# Altium schematic sheet UMDK.SchDoc
size C
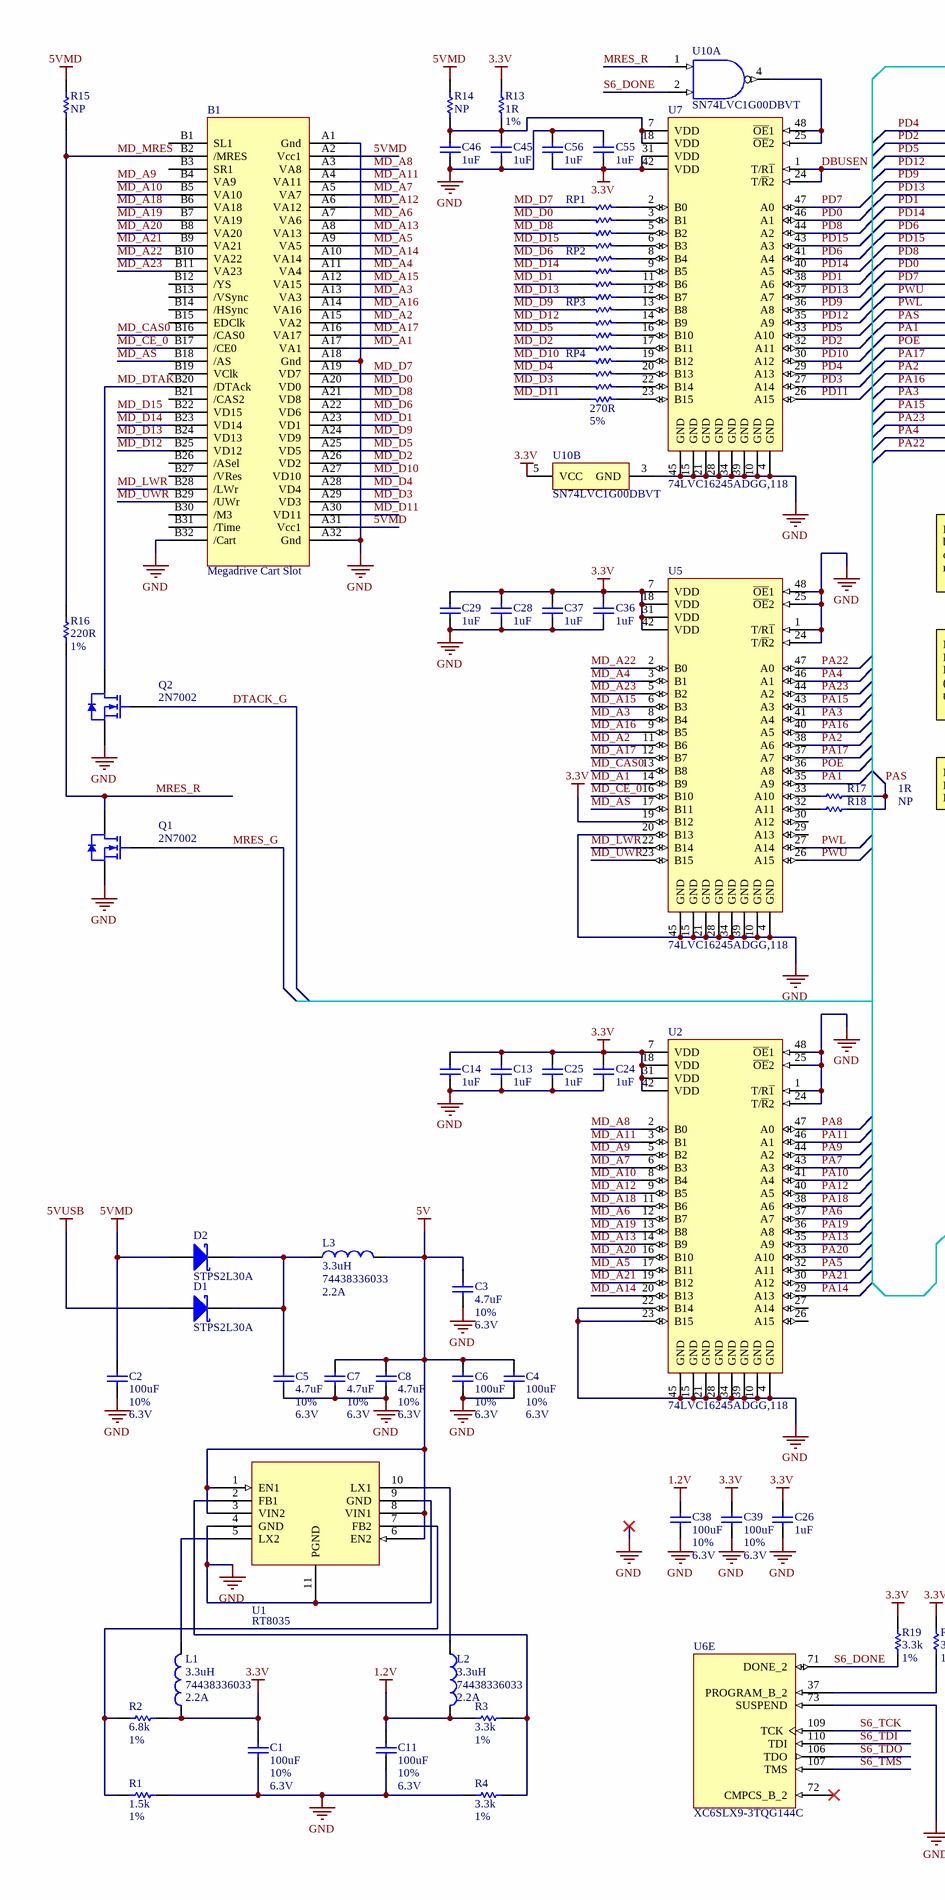
[diagram p0: UMDK.SchDoc, left]
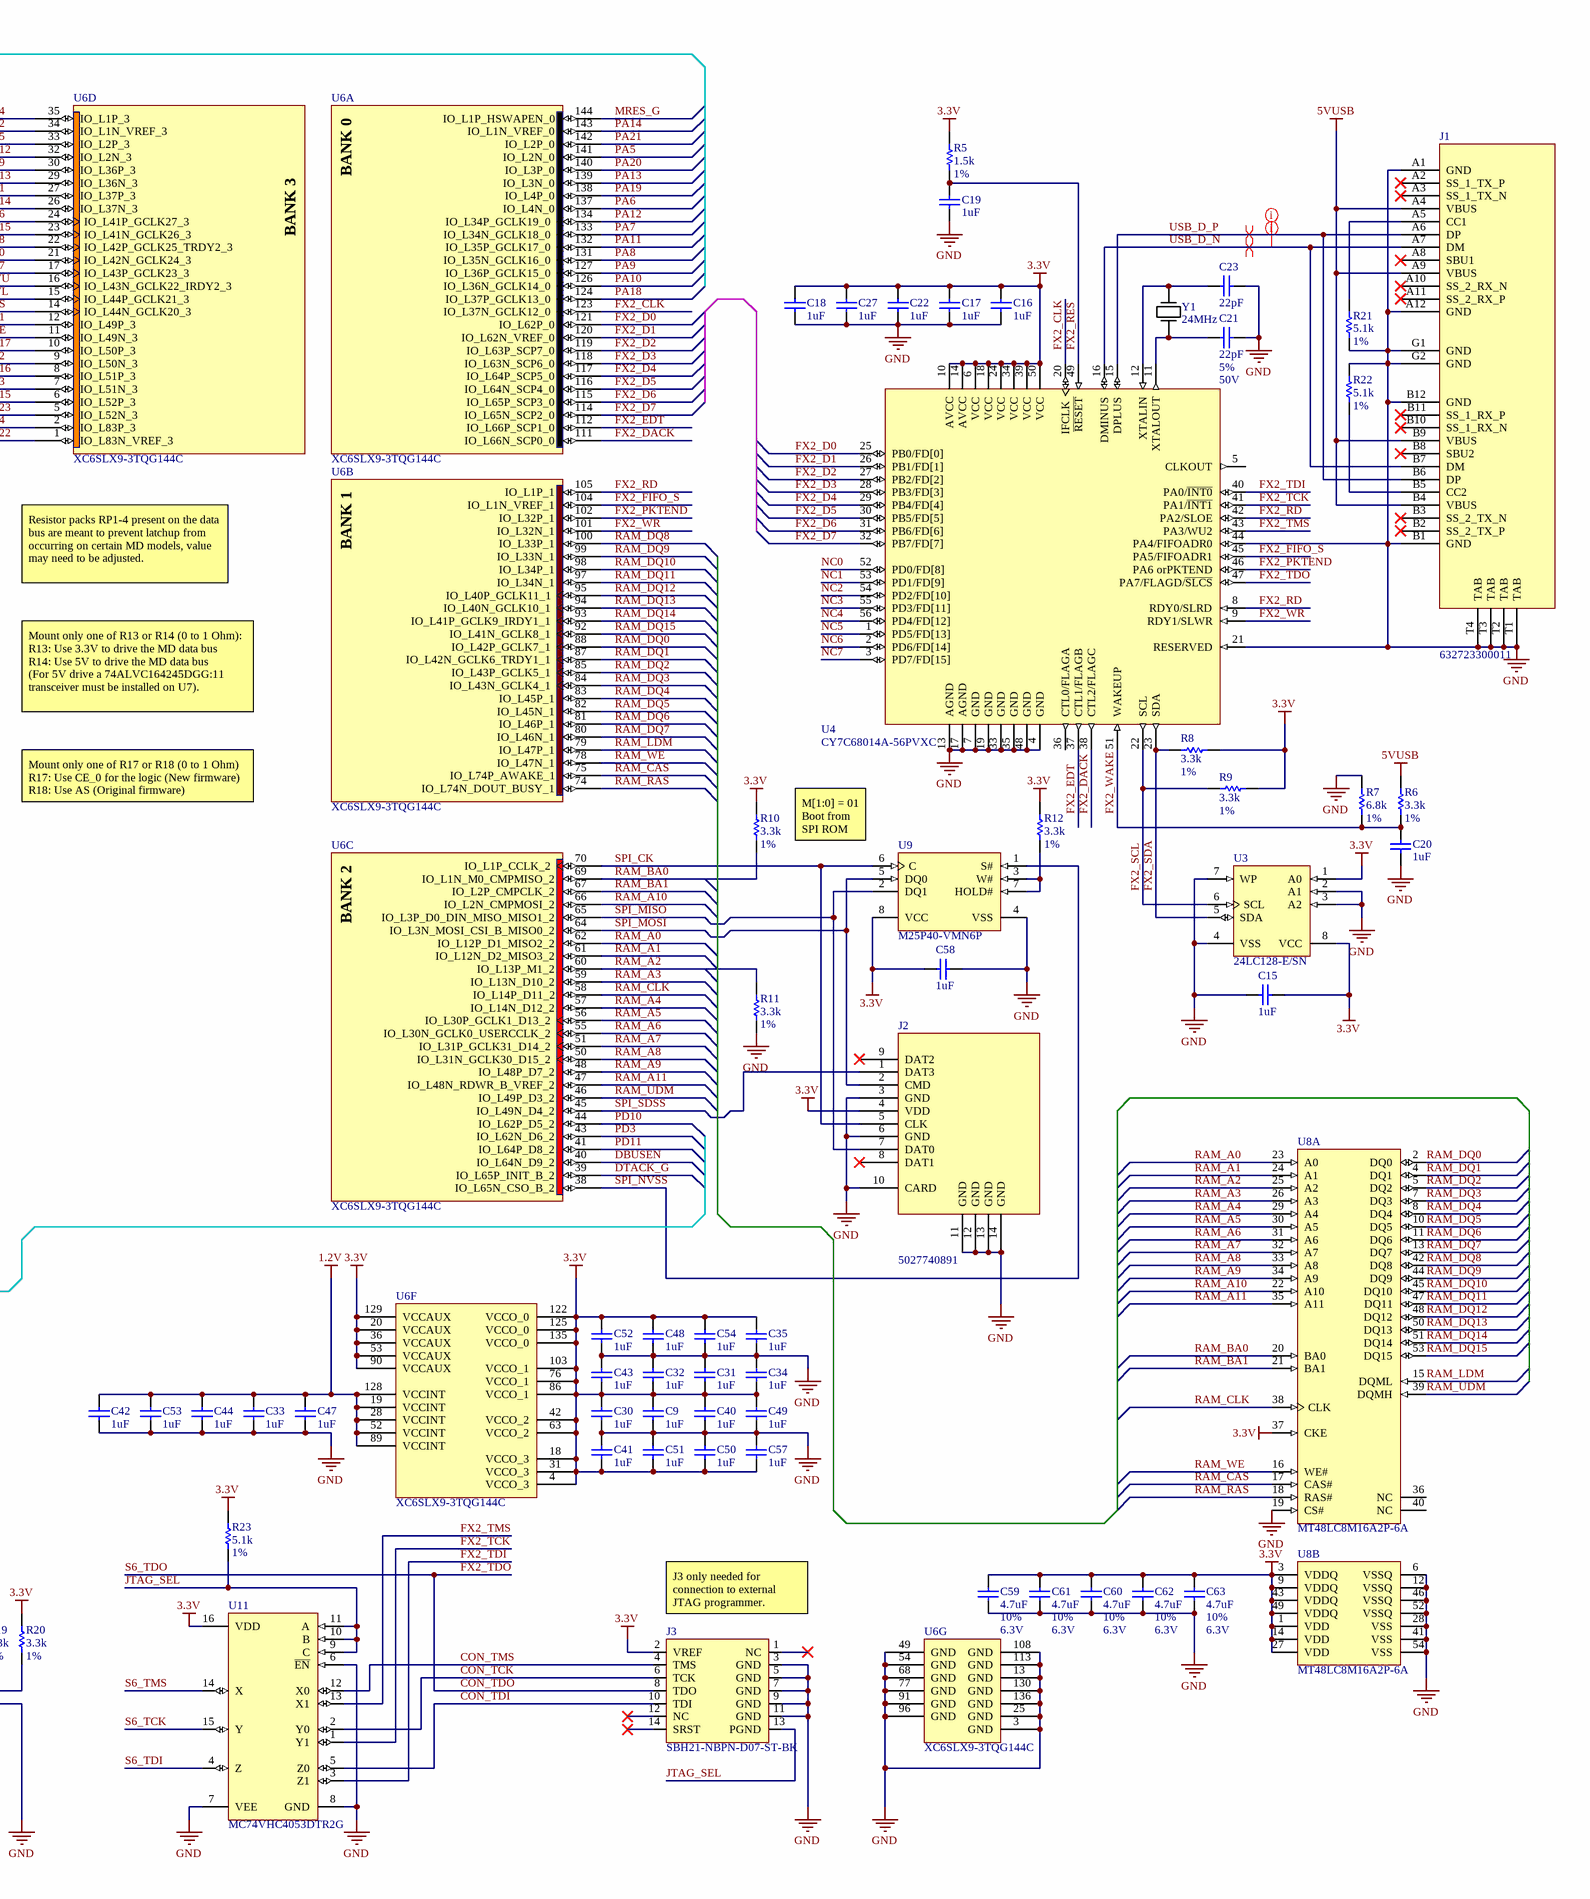
[diagram p1: UMDK.SchDoc, right]

## Parts
B1  Megadrive Cart Slot  [MD CART EDGE]  (no BOM)
C1  Tolerance: 10%  Voltage: 6.3V  [C-1210]  (hidden comment: 100uF)
C2  Tolerance: 10%  Voltage: 6.3V  [C-1210]  (hidden comment: 100uF)
C3  Tolerance: 10%  Voltage: 6.3V  [C-0603]  (hidden comment: 4.7uF)
C4  Tolerance: 10%  Voltage: 6.3V  [C-1210]  (hidden comment: 100uF)
C5  Tolerance: 10%  Voltage: 6.3V  [C-0603]  (hidden comment: 4.7uF)
C6  Tolerance: 10%  Voltage: 6.3V  [C-1210]  (hidden comment: 100uF)
C7  Tolerance: 10%  Voltage: 6.3V  [C-0603]  (hidden comment: 4.7uF)
C8  Tolerance: 10%  Voltage: 6.3V  [C-0603]  (hidden comment: 4.7uF)
C9  1uF  [C-0402]
C11  Tolerance: 10%  Voltage: 6.3V  [C-1210]  (hidden comment: 100uF)
C13  1uF  [C-0402]
C14  1uF  [C-0402]
C15  1uF  [C-0402]
C16  1uF  [C-0402]
C17  1uF  [C-0402]
C18  1uF  [C-0402]
C19  1uF  [C-0402]
C20  1uF  [C-0402]
C21  Tolerance: 5%  Voltage: 50V  [C-0402]  (hidden comment: 22pF)
C22  1uF  [C-0402]
C23  22pF  [C-0402]
C24  1uF  [C-0402]
C25  1uF  [C-0402]
C26  1uF  [C-0402]
C27  1uF  [C-0402]
C28  1uF  [C-0402]
C29  1uF  [C-0402]
C30  1uF  [C-0402]
C31  1uF  [C-0402]
C32  1uF  [C-0402]
C33  1uF  [C-0402]
C34  1uF  [C-0402]
C35  1uF  [C-0402]
C36  1uF  [C-0402]
C37  1uF  [C-0402]
C38  Tolerance: 10%  Voltage: 6.3V  [C-1210]  (hidden comment: 100uF)
C39  Tolerance: 10%  Voltage: 6.3V  [C-1210]  (hidden comment: 100uF)
C40  1uF  [C-0402]
C41  1uF  [C-0402]
C42  1uF  [C-0402]
C43  1uF  [C-0402]
C44  1uF  [C-0402]
C45  1uF  [C-0402]
C46  1uF  [C-0402]
C47  1uF  [C-0402]
C48  1uF  [C-0402]
C49  1uF  [C-0402]
C50  1uF  [C-0402]
C51  1uF  [C-0402]
C52  1uF  [C-0402]
C53  1uF  [C-0402]
C54  1uF  [C-0402]
C55  1uF  [C-0402]
C56  1uF  [C-0402]
C57  1uF  [C-0402]
C58  1uF  [C-0402]
C59  Tolerance: 10%  Voltage: 6.3V  [C-0603]  (hidden comment: 4.7uF)
C60  Tolerance: 10%  Voltage: 6.3V  [C-0603]  (hidden comment: 4.7uF)
C61  Tolerance: 10%  Voltage: 6.3V  [C-0603]  (hidden comment: 4.7uF)
C62  Tolerance: 10%  Voltage: 6.3V  [C-0603]  (hidden comment: 4.7uF)
C63  Tolerance: 10%  Voltage: 6.3V  [C-0603]  (hidden comment: 4.7uF)
D1  Manufacturer Part Number: STPS2L30A  [D-SMA]  (hidden comment: B230A-13-F)
D2  Manufacturer Part Number: STPS2L30A  [D-SMA]  (hidden comment: B230A-13-F)
J1  632723300011  [632723300011]
J2  5027740891  [5027740891]
J3  SBH21-NBPN-D07-ST-BK  [AWHW2 14G-0202]  (no BOM)
L1  Manufacturer Part Number: 74438336033  Current: 2.2A  [I-1212]  (hidden comment: 3.3uH)
L2  Manufacturer Part Number: 74438336033  Current: 2.2A  [I-1212]  (hidden comment: 3.3uH)
L3  Manufacturer Part Number: 74438336033  Current: 2.2A  [I-1212]  (hidden comment: 3.3uH)
Q1  2N7002  [T-SOT23]
Q2  2N7002  [T-SOT23]
R1  1.5k  Tolerance: 1%  [R-0402]
R2  Tolerance: 1%  [R-0402]  (hidden comment: 6.8k)
R3  Tolerance: 1%  [R-0402]  (hidden comment: 3.3k)
R4  Tolerance: 1%  [R-0402]  (hidden comment: 3.3k)
R5  1.5k  Tolerance: 1%  [R-0402]
R6  Tolerance: 1%  [R-0402]  (hidden comment: 3.3k)
R7  Tolerance: 1%  [R-0402]  (hidden comment: 6.8k)
R8  Tolerance: 1%  [R-0402]  (hidden comment: 3.3k)
R9  Tolerance: 1%  [R-0402]  (hidden comment: 3.3k)
R10  Tolerance: 1%  [R-0402]  (hidden comment: 3.3k)
R11  Tolerance: 1%  [R-0402]  (hidden comment: 3.3k)
R12  Tolerance: 1%  [R-0402]  (hidden comment: 3.3k)
R13  Tolerance: 1%  [R-0402]  (hidden comment: 1R)
R14  NP  [R-0402]  (no BOM)
R15  NP  [R-0402]  (no BOM)
R16  Tolerance: 1%  [R-0402]  (hidden comment: 220R)
R17  1R  [R-0402]
R18  NP  [R-0402]  (no BOM)
R19  Tolerance: 1%  [R-0402]  (hidden comment: 3.3k)
R20  Tolerance: 1%  [R-0402]  (hidden comment: 3.3k)
R21  Tolerance: 1%  [R-0402]  (hidden comment: 5.1k)
R22  Tolerance: 1%  [R-0402]  (hidden comment: 5.1k)
R23  Tolerance: 1%  [R-0402]  (hidden comment: 5.1k)
RP1  270R  [RP4-1206]  (value not drawn)
RP2  270R  [RP4-1206]  (value not drawn)
RP3  270R  [RP4-1206]  (value not drawn)
RP4  Tolerance: 5%  [RP4-1206]  (hidden comment: 270R)
U1  RT8035  [10SON]
U2  74LVC16245ADGG,118  [1201-01_L]
U3  24LC128-E/SN  [SOIC-SN8_N]
U4  CY7C68014A-56PVXC  [O56_N]
U5  74LVC16245ADGG,118  [1201-01_L]
U6  XC6SLX9-3TQG144C  [TQG144_N]  (parts A,B,C,D,E,F,G of 7)
U7  74LVC16245ADGG,118  [1201-01_L]
U8  MT48LC8M16A2P-6A  [MICT-P-54_N]  (parts A,B of 2)
U9  M25P40-VMN6P  [MICT-MN-8_N]
U10  SN74LVC1G00DBVT  [DBV0005A_N]  (parts A,B of 2)
U11  MC74VHC4053DTR2G  [948F-01_N]
Y1  24MHz  [CRYSTAL_HC49-US-SM]

## Nets
1.2V: C11.2 C33.1 C38.2 C42.1 C44.1 C47.1 C53.1 L2.2 R3.2 U6.19(VCCINT) U6.28(VCCINT) U6.52(VCCINT) U6.89(VCCINT) U6.128(VCCINT)
3.3V: C1.2 C9.1 C13.1 C14.1 C15.1 C16.1 C17.1 C18.1 C22.1 C24.1 C25.1 C26.1 C27.1 C28.1 C29.1 C30.1 C31.2 C32.2 C34.2 C35.1 C36.1 C37.1 C39.2 C40.1 C41.2 C43.2 C48.1 C49.1 C50.2 C51.2 C52.1 C54.1 C55.2 C56.2 C57.2 C58.2 C59.2 C60.2 C61.2 C62.2 C63.2 J2.4(VDD) J3.2(VREF) L1.1 R2.1 R5.1 R8.2 R9.2 R10.1 R12.2 R13.1 R19.1 R20.1 R23.1 U2.7(VDD) U2.18(VDD) U2.31(VDD) U2.42(VDD) U3.1(A0) U3.8(VCC) U4.6(VCC) U4.10(AVCC) U4.14(AVCC) U4.18(VCC) U4.24(VCC) U4.34(VCC) U4.39(VCC) U4.50(VCC) U5.7(VDD) U5.18(VDD) U5.19(B12) U5.31(VDD) U5.42(VDD) U6.4(VCCO_3) U6.18(VCCO_3) U6.20(VCCAUX) U6.31(VCCO_3) U6.36(VCCAUX) U6.42(VCCO_2) U6.53(VCCAUX) U6.63(VCCO_2) U6.76(VCCO_1) U6.86(VCCO_1) U6.90(VCCAUX) U6.103(VCCO_1) U6.122(VCCO_0) U6.125(VCCO_0) U6.129(VCCAUX) U6.135(VCCO_0) U7.31(VDD) U7.42(VDD) U8.1(VDD) U8.3(VDDQ) U8.9(VDDQ) U8.14(VDD) U8.27(VDD) U8.37(CKE) U8.43(VDDQ) U8.49(VDDQ) U9.8(VCC) U10.5(VCC) U11.16(VDD)
5V: C3.2 C4.2 C6.1 C7.2 C8.1 L3.2 U1.1(EN1) U1.3(VIN2) U1.6(EN2) U1.8(VIN1)
5VMD: B1.A2(Vcc1) B1.A31(Vcc1) C2.2 D2.2(A) R14.1 R15.2
5VUSB: D1.2(A) J1.A4(VBUS) J1.A9(VBUS) J1.B4(VBUS) J1.B9(VBUS) R6.1
GND: B1.A1(Gnd) B1.A18(Gnd) B1.A32(Gnd) B1.B32(/Cart) C1.1 C2.1 C3.1 C4.1 C5.1 C6.2 C7.1 C8.2 C9.2 C11.1 C13.2 C14.2 C15.2 C16.2 C17.2 C18.2 C19.2 C20.2 C21.2 C22.2 C23.2 C24.2 C25.2 C26.2 C27.2 C28.2 C29.2 C30.2 C31.1 C32.1 C33.2 C34.1 C35.2 C36.2 C37.2 C38.1 C39.1 C40.2 C41.1 C42.2 C43.1 C44.2 C45.2 C46.1 C47.2 C48.2 C49.2 C50.1 C51.1 C52.2 C53.2 C54.2 C55.1 C56.1 C57.1 C58.1 C59.1 C60.1 C61.1 C62.1 C63.1 J1.A1(GND) J1.A12(GND) J1.B1(GND) J1.B12(GND) J1.G1(GND) J1.G2(GND) J1.T1(TAB) J1.T2(TAB) J1.T3(TAB) J1.T4(TAB) J2.3(GND) J2.6(GND) J2.10(CARD) J2.11(GND) J2.12(GND) J2.13(GND) J2.14(GND) J3.3(GND) J3.5(GND) J3.7(GND) J3.9(GND) J3.11(GND) Q1.2(SOURCE) Q2.2(SOURCE) R1.2 R4.2 R7.2 R11.2 R21.2 R22.1 U1.4(GND) U1.9(GND) U1.11(PGND) U2.1(T/R~{1}) U2.4(GND) U2.10(GND) U2.15(GND) U2.21(GND) U2.22(B14) U2.23(B15) U2.24(T/~{R}2) U2.25(~{OE}2) U2.28(GND) U2.34(GND) U2.39(GND) U2.45(GND) U2.48(~{OE}1) U3.2(A1) U3.3(A2) U3.4(VSS) U3.7(WP) U4.4(GND) U4.7(GND) U4.13(AGND) U4.17(AGND) U4.19(GND) U4.21(RESERVED) U4.33(GND) U4.35(GND) U4.44(PA4/FIFOADR0) U4.48(GND) U5.1(T/R~{1}) U5.4(GND) U5.10(GND) U5.15(GND) U5.20(B13) U5.21(GND) U5.24(T/~{R}2) U5.25(~{OE}2) U5.28(GND) U5.34(GND) U5.39(GND) U5.45(GND) U5.48(~{OE}1) U6.3(GND) U6.13(GND) U6.25(GND) U6.49(GND) U6.54(GND) U6.68(GND) U6.73(SUSPEND) U6.77(GND) U6.91(GND) U6.96(GND) U6.108(GND) U6.113(GND) U6.130(GND) U6.136(GND) U7.4(GND) U7.10(GND) U7.15(GND) U7.21(GND) U7.28(GND) U7.34(GND) U7.39(GND) U7.45(GND) U8.6(VSSQ) U8.12(VSSQ) U8.19(CS#) U8.28(VSS) U8.41(VSS) U8.46(VSSQ) U8.52(VSSQ) U8.54(VSS) U9.4(VSS) U10.3(GND) U11.6(~{EN}) U11.7(VEE) U11.8(GND)
CON_TCK: J3.6(TCK) U11.2(Y0)
CON_TDI: J3.10(TDI) U11.5(Z0)
CON_TDO: J3.8(TDO) U4.47(PA7/FLAGD/~{SLCS}) U6.106(TDO)  [also labelled FX2_TDO, S6_TDO]
CON_TMS: J3.4(TMS) U11.12(X0)
DBUSEN: U6.40(IO_L64N_D9_2) U7.1(T/R~{1}) U7.24(T/~{R}2)
DTACK_G: Q2.1(GATE) U6.39(IO_L65P_INIT_B_2)
FX2_CLK: U4.20(IFCLK) U6.123(IO_L37N_GCLK12_0)
FX2_D0: U4.25(PB0/FD[0]) U6.121(IO_L62P_0)
FX2_D1: U4.26(PB1/FD[1]) U6.120(IO_L62N_VREF_0)
FX2_D2: U4.27(PB2/FD[2]) U6.119(IO_L63P_SCP7_0)
FX2_D3: U4.28(PB3/FD[3]) U6.118(IO_L63N_SCP6_0)
FX2_D4: U4.29(PB4/FD[4]) U6.117(IO_L64P_SCP5_0)
FX2_D5: U4.30(PB5/FD[5]) U6.116(IO_L64N_SCP4_0)
FX2_D6: U4.31(PB6/FD[6]) U6.115(IO_L65P_SCP3_0)
FX2_D7: U4.32(PB7/FD[7]) U6.114(IO_L65N_SCP2_0)
FX2_DACK: U4.38(CTL2/FLAGC) U6.111(IO_L66N_SCP0_0)
FX2_EDT: U4.37(CTL1/FLAGB) U6.112(IO_L66P_SCP1_0)
FX2_FIFO_S: U4.45(PA5/FIFOADR1) U6.104(IO_L1N_VREF_1)
FX2_PKTEND: U4.46(PA6_orPKTEND) U6.102(IO_L32P_1)
FX2_RD: U4.8(RDY0/SLRD) U4.42(PA2/SLOE) U6.105(IO_L1P_1)
FX2_RES: C19.1 R5.2 U4.49(~{RESET})
FX2_SCL: R9.1 U3.6(SCL) U4.22(SCL)
FX2_SDA: R8.1 U3.5(SDA) U4.23(SDA)
FX2_TCK: U4.41(PA1/~{INT1}) U11.1(Y1)
FX2_TDI: U4.40(PA0/~{INT0}) U11.3(Z1)
FX2_TMS: U4.43(PA3/WU2) U11.13(X1)
FX2_WAKE: C20.1 R6.2 R7.1 U4.51(WAKEUP)
FX2_WR: U4.9(RDY1/SLWR) U6.101(IO_L32N_1)
JTAG_SEL: J3.13(PGND) R23.2 U11.9(C) U11.10(B) U11.11(A)
MD_A1: B1.A17(VA1) U5.14(B9)
MD_A2: B1.A15(VA2) U5.11(B6)
MD_A3: B1.A13(VA3) U5.8(B4)
MD_A4: B1.A11(VA4) U5.3(B1)
MD_A5: B1.A9(VA5) U2.17(B11)
MD_A6: B1.A7(VA6) U2.12(B7)
MD_A7: B1.A5(VA7) U2.6(B3)
MD_A8: B1.A3(VA8) U2.2(B0)
MD_A9: B1.B4(VA9) U2.5(B2)
MD_A10: B1.B5(VA10) U2.8(B4)
MD_A11: B1.A4(VA11) U2.3(B1)
MD_A12: B1.A6(VA12) U2.9(B5)
MD_A13: B1.A8(VA13) U2.14(B9)
MD_A14: B1.A10(VA14) U2.20(B13)
MD_A15: B1.A12(VA15) U5.6(B3)
MD_A16: B1.A14(VA16) U5.9(B5)
MD_A17: B1.A16(VA17) U5.12(B7)
MD_A18: B1.B6(VA18) U2.11(B6)
MD_A19: B1.B7(VA19) U2.13(B8)
MD_A20: B1.B8(VA20) U2.16(B10)
MD_A21: B1.B9(VA21) U2.19(B12)
MD_A22: B1.B10(VA22) U5.2(B0)
MD_A23: B1.B11(VA23) U5.5(B2)
MD_AS: B1.B18(/AS) U5.17(B11)
MD_CAS0: B1.B16(/CAS0) U5.13(B8)
MD_CE_0: B1.B17(/CE0) U5.16(B10)
MD_D0: B1.A20(VD0) RP1.6
MD_D1: B1.A23(VD1) RP2.4
MD_D2: B1.A26(VD2) RP3.2
MD_D3: B1.A29(VD3) RP4.4
MD_D4: B1.A28(VD4) RP4.6
MD_D5: B1.A25(VD5) RP3.4
MD_D6: B1.A22(VD6) RP2.8
MD_D7: B1.A19(VD7) RP1.8
MD_D8: B1.A21(VD8) RP1.4
MD_D9: B1.A24(VD9) RP3.8
MD_D10: B1.A27(VD10) RP4.8
MD_D11: B1.A30(VD11) RP4.2
MD_D12: B1.B25(VD12) RP3.6
MD_D13: B1.B24(VD13) RP2.2
MD_D14: B1.B23(VD14) RP2.6
MD_D15: B1.B22(VD15) RP1.2
MD_DTAK: B1.B20(/DTAck) Q2.3(DRAIN)
MD_LWR: B1.B28(/LWr) U5.22(B14)
MD_MRES: B1.B2(/MRES) R15.1 R16.1
MD_UWR: B1.B29(/UWr) U5.23(B15)
MRES_G: Q1.1(GATE) U6.144(IO_L1P_HSWAPEN_0)
MRES_R: Q1.3(DRAIN) R16.2 U10.1(A)
NC0: U4.52(PD0/FD[8])
NC1: U4.53(PD1/FD[9])
NC2: U4.54(PD2/FD[10])
NC3: U4.55(PD3/FD[11])
NC4: U4.56(PD4/FD[12])
NC5: U4.1(PD5/FD[13])
NC6: U4.2(PD6/FD[14])
NC7: U4.3(PD7/FD[15])
PA1: U5.35(A9) U6.12(IO_L49P_3)
PA2: U5.38(A6) U6.9(IO_L50N_3)
PA3: U5.41(A4) U6.7(IO_L51N_3)
PA4: U5.46(A1) U6.2(IO_L83P_3)
PA5: U2.32(A11) U6.141(IO_L2N_0)
PA6: U2.37(A7) U6.137(IO_L4N_0)
PA7: U2.43(A3) U6.133(IO_L34N_GCLK18_0)
PA8: U2.47(A0) U6.131(IO_L35N_GCLK16_0)
PA9: U2.44(A2) U6.127(IO_L36P_GCLK15_0)
PA10: U2.41(A4) U6.126(IO_L36N_GCLK14_0)
PA11: U2.46(A1) U6.132(IO_L35P_GCLK17_0)
PA12: U2.40(A5) U6.134(IO_L34P_GCLK19_0)
PA13: U2.35(A9) U6.139(IO_L3N_0)
PA14: U2.29(A13) U6.143(IO_L1N_VREF_0)
PA15: U5.43(A3) U6.6(IO_L52P_3)
PA16: U5.40(A5) U6.8(IO_L51P_3)
PA17: U5.37(A7) U6.10(IO_L50P_3)
PA18: U2.38(A6) U6.124(IO_L37P_GCLK13_0)
PA19: U2.36(A8) U6.138(IO_L4P_0)
PA20: U2.33(A10) U6.140(IO_L3P_0)
PA21: U2.30(A12) U6.142(IO_L2P_0)
PA22: U5.47(A0) U6.1(IO_L83N_VREF_3)
PA23: U5.44(A2) U6.5(IO_L52N_3)
PAS: R17.2 R18.2 U6.14(IO_L44N_GCLK20_3)
PD0: U6.21(IO_L42N_GCLK24_3) U7.46(A1)
PD1: U6.27(IO_L37P_3) U7.38(A6)
PD2: U6.34(IO_L1N_VREF_3) U7.32(A11)
PD3: U6.43(IO_L62N_D6_2) U7.27(A14)
PD4: U6.35(IO_L1P_3) U7.29(A13)
PD5: U6.33(IO_L2P_3) U7.33(A10)
PD6: U6.24(IO_L41P_GCLK27_3) U7.41(A4)
PD7: U6.17(IO_L43P_GCLK23_3) U7.47(A0)
PD8: U6.22(IO_L42P_GCLK25_TRDY2_3) U7.44(A2)
PD9: U6.30(IO_L36P_3) U7.36(A8)
PD10: U6.44(IO_L62P_D5_2) U7.30(A12)
PD11: U6.41(IO_L64P_D8_2) U7.26(A15)
PD12: U6.32(IO_L2N_3) U7.35(A9)
PD13: U6.29(IO_L36N_3) U7.37(A7)
PD14: U6.26(IO_L37N_3) U7.40(A5)
PD15: U6.23(IO_L41N_GCLK26_3) U7.43(A3)
POE: U5.36(A8) U6.11(IO_L49N_3)
PWL: U5.27(A14) U6.15(IO_L44P_GCLK21_3)
PWU: U5.26(A15) U6.16(IO_L43N_GCLK22_IRDY2_3)
RAM_A0: U6.62(IO_L12P_D1_MISO2_2) U8.23(A0)
RAM_A1: U6.61(IO_L12N_D2_MISO3_2) U8.24(A1)
RAM_A2: R11.1 U6.60(IO_L13P_M1_2) U8.25(A2)
RAM_A3: U6.59(IO_L13N_D10_2) U8.26(A3)
RAM_A4: U6.57(IO_L14N_D12_2) U8.29(A4)
RAM_A5: U6.56(IO_L30P_GCLK1_D13_2) U8.30(A5)
RAM_A6: U6.55(IO_L30N_GCLK0_USERCCLK_2) U8.31(A6)
RAM_A7: U6.51(IO_L31P_GCLK31_D14_2) U8.32(A7)
RAM_A8: U6.50(IO_L31N_GCLK30_D15_2) U8.33(A8)
RAM_A9: U6.48(IO_L48P_D7_2) U8.34(A9)
RAM_A10: U6.66(IO_L2N_CMPMOSI_2) U8.22(A10)
RAM_A11: U6.47(IO_L48N_RDWR_B_VREF_2) U8.35(A11)
RAM_BA0: R10.2 U6.69(IO_L1N_M0_CMPMISO_2) U8.20(BA0)
RAM_BA1: U6.67(IO_L2P_CMPCLK_2) U8.21(BA1)
RAM_CAS: U6.75(IO_L74P_AWAKE_1) U8.17(CAS#)
RAM_CLK: U6.58(IO_L14P_D11_2) U8.38(CLK)
RAM_DQ0: U6.88(IO_L42P_GCLK7_1) U8.2(DQ0)
RAM_DQ1: U6.87(IO_L42N_GCLK6_TRDY1_1) U8.4(DQ1)
RAM_DQ2: U6.85(IO_L43P_GCLK5_1) U8.5(DQ2)
RAM_DQ3: U6.84(IO_L43N_GCLK4_1) U8.7(DQ3)
RAM_DQ4: U6.83(IO_L45P_1) U8.8(DQ4)
RAM_DQ5: U6.82(IO_L45N_1) U8.10(DQ5)
RAM_DQ6: U6.81(IO_L46P_1) U8.11(DQ6)
RAM_DQ7: U6.80(IO_L46N_1) U8.13(DQ7)
RAM_DQ8: U6.100(IO_L33P_1) U8.42(DQ8)
RAM_DQ9: U6.99(IO_L33N_1) U8.44(DQ9)
RAM_DQ10: U6.98(IO_L34P_1) U8.45(DQ10)
RAM_DQ11: U6.97(IO_L34N_1) U8.47(DQ11)
RAM_DQ12: U6.95(IO_L40P_GCLK11_1) U8.48(DQ12)
RAM_DQ13: U6.94(IO_L40N_GCLK10_1) U8.50(DQ13)
RAM_DQ14: U6.93(IO_L41P_GCLK9_IRDY1_1) U8.51(DQ14)
RAM_DQ15: U6.92(IO_L41N_GCLK8_1) U8.53(DQ15)
RAM_LDM: U6.79(IO_L47P_1) U8.15(DQML)
RAM_RAS: U6.74(IO_L74N_DOUT_BUSY_1) U8.18(RAS#)
RAM_UDM: U6.46(IO_L49P_D3_2) U8.39(DQMH)
RAM_WE: U6.78(IO_L47N_1) U8.16(WE#)
S6_DONE: R19.2 U6.71(DONE_2) U10.2(B)
S6_TCK: U6.109(TCK) U11.15(Y)
S6_TDI: U6.110(TDI) U11.4(Z)
S6_TMS: U6.107(TMS) U11.14(X)
SPI_CK: J2.5(CLK) U6.70(IO_L1P_CCLK_2) U9.6(C)
SPI_MISO: J2.7(DAT0) U6.65(IO_L3P_D0_DIN_MISO_MISO1_2) U9.2(DQ1)
SPI_MOSI: J2.2(CMD) U6.64(IO_L3N_MOSI_CSI_B_MISO0_2) U9.5(DQ0)
SPI_NVSS: U6.38(IO_L65N_CSO_B_2) U9.1(S#)
SPI_SDSS: J2.1(DAT3) U6.45(IO_L49N_D4_2)
USB_D_N: J1.A7(DM) J1.B7(DM) U4.16(DMINUS)
USB_D_P: J1.A6(DP) J1.B6(DP) U4.15(DPLUS)
NetC5_2: C5.2 D1.1(K) D2.1(K) L3.1
NetC21_1: C21.1 U4.11(XTALOUT) Y1.1(IN)
NetC23_1: C23.1 U4.12(XTALIN) Y1.2(OUT)
NetC45_1: C45.1 C46.2 R13.2 R14.2 U7.7(VDD) U7.18(VDD)
NetJ1_A5: J1.A5(CC1) R21.1
NetJ1_B5: J1.B5(CC2) R22.2
NetL1_2: L1.2 U1.5(LX2)
NetL2_1: L2.1 U1.10(LX1)
NetR1_1: R1.1 R2.2 U1.7(FB2)
NetR3_1: R3.1 R4.1 U1.2(FB1)
NetR12_1: R12.1 U9.3(W#) U9.7(HOLD#)
NetR17_1: R17.1 U5.33(A10)
NetR18_1: R18.1 U5.32(A11)
NetR20_2: R20.2 U6.37(PROGRAM_B_2)
NetRP1_1: RP1.1 U7.6(B3)
NetRP1_3: RP1.3 U7.5(B2)
NetRP1_5: RP1.5 U7.3(B1)
NetRP1_7: RP1.7 U7.2(B0)
NetRP2_1: RP2.1 U7.12(B7)
NetRP2_3: RP2.3 U7.11(B6)
NetRP2_5: RP2.5 U7.9(B5)
NetRP2_7: RP2.7 U7.8(B4)
NetRP3_1: RP3.1 U7.17(B11)
NetRP3_3: RP3.3 U7.16(B10)
NetRP3_5: RP3.5 U7.14(B9)
NetRP3_7: RP3.7 U7.13(B8)
NetRP4_1: RP4.1 U7.23(B15)
NetRP4_3: RP4.3 U7.22(B14)
NetRP4_5: RP4.5 U7.20(B13)
NetRP4_7: RP4.7 U7.19(B12)
NetU7_25: U7.25(~{OE}2) U7.48(~{OE}1) U10.4(Y)

Not connected (* = marked no-connect by the designer): B1 B1(SL1) B3(SR1) B12(/YS) B13(/VSync) B14(/HSync) B15(EDClk) B19(VClk) B21(/CAS2) B26(/ASel) B27(/VRes) B30(/M3) B31(/Time); J1 A2(SS_1_TX_P)* A3(SS_1_TX_N)* A8(SBU1)* A10(SS_2_RX_N)* A11(SS_2_RX_P)* B2(SS_2_TX_P)* B3(SS_2_TX_N)* B8(SBU2)* B10(SS_1_RX_N)* B11(SS_1_RX_P)*; J2 8(DAT1)* 9(DAT2)*; J3 1(NC)* 12(NC)* 14(SRST)*; U2 26(A15) 27(A14); U4 5(CLKOUT) 36(CTL0/FLAGA); U5 29(A13) 30(A12); U6 72(CMPCS_B_2)*; U8 36(NC) 40(NC)

## Layout directives
differential pair: USB_D_N, USB_D_P
net class USB: USB_D_N, USB_D_P

## Notes on the sheet
- Resistor packs RP1-4 present on the data bus are meant to prevent latchup from occurring on certain MD models, value may need to be adjusted.
- Mount only one of R13 or R14 (0 to 1 Ohm):
  R13: Use 3.3V to drive the MD data bus
  R14: Use 5V to drive the MD data bus
  (For 5V drive a 74ALVC164245DGG:11 transceiver must be installed on U7).
- Mount only one of R17 or R18 (0 to 1 Ohm)
  R17: Use CE_0 for the logic (New firmware)
  R18: Use AS (Original firmware)
- M[1:0] = 01
  Boot from SPI ROM
- (near J3) J3 only needed for connection to external JTAG programmer.
- (in symbol XC6SLX9-3TQG144C, part A) BANK 0
- (in symbol XC6SLX9-3TQG144C, part B) BANK 1
- (in symbol XC6SLX9-3TQG144C, part C) BANK 2
- (in symbol XC6SLX9-3TQG144C, part D) BANK 3

## Library data of the parts
B1 = Megadrive Cart Slot: Megadrive Cart Edge Connector
C1 C2 C4 C6 C11 C38 C39 = CAP_SMD: SMD Capacitor; Manufacturer Part Number: C1210C107M9PAC7800; Manufacturer: Kemet; Value: 100uF; Package: =Footprint
C3 C5 C7 C8 C59-C63 = CAP_SMD: SMD Capacitor; Manufacturer Part Number: C0603C475K9PAC7867; Manufacturer: Kemet; Value: 4.7uF; Package: =Footprint
C9 C13-C20 C22 C24-C37 C40-C58 = CAP_SMD: SMD Capacitor; Manufacturer Part Number: C0402C105K9PAC7867; Manufacturer: Kemet; Tolerance: 10%; Voltage: 6.3V; Value: 1uF; Package: =Footprint
C21 = CAP_SMD: SMD Capacitor; Manufacturer Part Number: C0402C220J5GACTU; Manufacturer: Kemet; Value: 22pF; Package: =Footprint
C23 = CAP_SMD: SMD Capacitor; Manufacturer Part Number: C0402C220J5GACTU; Manufacturer: Kemet; Tolerance: 5%; Voltage: 50V; Value: 22pF; Package: =Footprint
D1 D2 = Schottky_SMD: Schottky Diode; Manufacturer: ST Microelectronics; Package: =Footprint
J1 = 632723300011: Manufacturer: Wuerth Elektronik; Manufacturer Part Number: 632723300011
J2 = 5027740891: Micro SDCard Slot Push Push; Manufacturer: Molex; Manufacturer Part Number: 5027740891
J3 = XILINX JTAG: Manufacturer: Sullins Connector Solutions; Manufacturer Part Number: SBH21-NBPN-D07-ST-BK
L1-L3 = IND_SMD: SMD Inductor; Manufacturer: Wuerth Elektronik; Tolerance: 20%; Value: 3.3uH; Package: =Footprint
Q1 Q2 = NMOS_SMD: N-Channel Mosfet; Manufacturer: Nexperia; Manufacturer Part Number: 2N7002,215; Package: =Footprint
R1 R5 = RES_SMD: SMD Resistor; Manufacturer Part Number: CRCW04021K50FKEDC; Manufacturer: Vishay; Value: 1.5k; Package: =Footprint
R2 R7 = RES_SMD: SMD Resistor; Manufacturer Part Number: CRCW04026K80FKEDC; Manufacturer: Vishay; Value: 6.8k; Package: =Footprint
R3 R4 R6 R8-R12 R19 R20 = RES_SMD: SMD Resistor; Manufacturer Part Number: CRCW04023K30FKEDC; Manufacturer: Vishay; Value: 3.3k; Package: =Footprint
R13 = RES_SMD: SMD Resistor; Manufacturer Part Number: CRCW04021R00FKEDC; Manufacturer: Vishay; Value: 1R; Package: =Footprint
R14 R15 R18 = RES_SMD: SMD Resistor; Value: NP; Package: =Footprint
R16 = RES_SMD: SMD Resistor; Manufacturer Part Number: CRCW0402220RFKEDC; Manufacturer: Vishay; Value: 220R; Package: =Footprint
R17 = RES_SMD: SMD Resistor; Manufacturer Part Number: CRCW04021R00FKEDC; Manufacturer: Vishay; Tolerance: 1%; Value: 1R; Package: =Footprint
R21-R23 = RES_SMD: SMD Resistor; Manufacturer Part Number: CRCW04025K10FKEDC; Manufacturer: Vishay; Value: 5.1k; Package: =Footprint
RP1-RP3 = RPACK4_SMD: SMD Resistor Pack of 4; Manufacturer Part Number: CAT16-271J4LF; Manufacturer: Bourns; Tolerance: 5%; Package: =Footprint; Value: 270R
RP4 = RPACK4_SMD: SMD Resistor Pack of 4; Manufacturer Part Number: CAT16-271J4LF; Manufacturer: Bourns; Package: =Footprint; Value: 270R
U1 = RT8035: DCDC Synchronous buck converter; Manufacturer Part Number: RT8035GQW; Manufacturer: Richtek USA Inc.
U2 U5 = MC74LCX16245DT: Low-Voltage 16-Bit 3-State Non-Inverting Transceiver with 5V-Tolerant Inputs and Outputs; Manufacturer: Nexperia; Manufacturer Part Number: 74LVC16245ADGG,118
U3 = 24LC128-E/SN: 128Kbit, 400kHz, 2.5V, I2C Serial EEPROM, 8-Pin SOIC 150mil, Extended Temperature; Manufacturer: Microchip; DatasheetVersion: revR, Apr-2009; PackageVersion: revBB, Aug-2009; PackageReference: SOIC-SN8; PackageDescription: 8-Lead Plastic SMD_All Outline (SN) - Narrow, 3.90mm Body [SOIC]; Supplier 1: Digi-Key; Supplier Part Number 1: 24LC128-E/SN-ND; Supplier 2: Newark; Supplier Part Number 2: 92C7132; Supplier 3: Mouser; Supplier Part Number 3: 579-24LC128-E/SN; Mounting Technology: Surface Mount; PartNumber: 24LC128-E/SN; ComponentLink1Description: MD_Anufacturer URL; ComponentLink1URL: http://www.microchip.com/; ComponentLink2Description: Datasheet; ComponentLink2URL: http://ww1.microchip.com/downloads/en/DeviceDoc/21191R.pdf; ComponentLink3Description: Package Specification; ComponentLink3URL: http://www.microchip.com/stellent/groups/techpub_sg/documents/packagingspec/en012702.pdf; Code_JEDEC: MS-012; Code_IPC: SOIC127P600-8; Manufacturer Part Number: 24LC128-E/SN
U4 = CY7C68014A-56PVXC: EZ-USB FX2LP USB Microcontroller Ideal for Battery Powered Applications,16K RAM, 24 I/Os, 56-Pin SSOP, Pb-Free, Commercial Grade; Manufacturer: Cypress; Published: 16-Dec-2005; LatestRevisionDate: 20-Nov-2009; LatestRevisionNote: IPC-7351 Footprint Added.; DatasheetVersion: rev.J, Sep-2005; PackageVersion: Feb-2005; PackageReference: O56; Publisher: Altium Limited; PackageDescription: 56-Pin SMD_All Outline Package 0.635 mm Pitch; Code_JEDEC: MO-118-AB; Code_IPC: SOP635P1035-56; ComponentLink1Description: MD_Anufacturer Link; ComponentLink1URL: http://www.cypress.com/portal/server.pt; ComponentLink2Description: Datasheet; ComponentLink2URL: http://www.cypress.com/portal/server.pt/gateway/PTARGS_0_2_1524_209_259_43/http%3B/sjapp20.mis.cypress.com%3B7001/publishedcontent/publish/design_resources/datasheets/contents/cy7c68014a_5.pdf; Manufacturer Part Number: CY7C68014A-56PVXC
U6 = XC6SLX9-3TQG144C: Spartan-6 LX 1.2V FPGA, 102 User I/Os, 144-Pin TQFP (0.5mm Pitch), Speed Grade 3, Commercial Grade, Pb-Free; Manufacturer: Xilinx; DatasheetVersion: ver1.6, Nov-2010; PackageVersion: ver1.2, Jun-2004; PackageReference: TQG144; PackageDescription: 144-Pin Thin Quad Flat Pack (TQG144) - Pb-Free; Code_JEDEC: MS-026-BFB; ComponentLink1Description: MD_Anufacturer URL; ComponentLink1URL: http://www.xilinx.com/; ComponentLink2Description: Spartan-6 Datasheet; ComponentLink2URL: http://www.xilinx.com/support/documentation/data_sheets/ds160.pdf; ComponentLink3Description: Spartan-6 Documents; ComponentLink3URL: http://www.xilinx.com/support/documentation/spartan-6.htm; Manufacturer Part Number: XC6SLX9-3TQG144C
U7 = MC74LCX16245DT: Low-Voltage 16-Bit 3-State Non-Inverting Transceiver with 5V-Tolerant Inputs and Outputs; Manufacturer Part Number: 74ALVC164245DGG:11; Manufacturer: Nexperia
U8 = MT48LC8M16A2P-6A: 128Mb PC133 SDR SDRAM, 8Mb x 16, 6ns, 3.3V, 0 to 70 degC, 54-Pin TSOP, Pb-Free; Manufacturer: Micron; CL: CL = 3; Clock Rate: 167 MHz; Op. Temp.: 0C to +70C; DatasheetVersion: Rev.Q; PackageVersion: Rev.Q; PackageReference: MICT-P-54; PackageDescription: 54-Pin Thin SMD_All Outline Package, 10.16 x 22.22 mm, Pitch 0.8 mm; Cycle Time: 6ns; Data Rate: PC133; Density: 128Mb; Depth: 8Mb; RoHS: Yes; Voltage: 3.3V; Width: x16; Mounting Technology: Surface Mount; PartNumber: MT48LC8M16A2P-6A; ComponentLink1Description: MD_Anufacturer URL; ComponentLink1URL: http://www.micron.com/; ComponentLink2Description: Datasheet; ComponentLink2URL: http://www.micron.com/~/media/Documents/Products/Data%20Sheet/DRAM/128mb_x4x8x16_sdram.pdf; ComponentLink3Description: Package Specification; ComponentLink3URL: http://www.micron.com/~/media/Documents/Products/Data%20Sheet/DRAM/128mb_x4x8x16_sdram.pdf; Manufacturer Part Number: MT48LC8M16A2P-6A
U9 = M25P40-VMN6P: 4 Mb (x1) Serial NOR Flash Memory, 75 MHz, 2.3 to 3.6 V, 8-pin SO8 Narrow (MN), Tube; Part Family: M25P; Manufacturer: Micron; Density: 4Mb; Speed: 75 MHz; Voltage: 2.3V-3.6V; DatasheetVersion: Rev. Y; PackageVersion: Rev 11; PackageReference: MICT-MN-8; PackageDescription: 8-Pin SO Narrow, 3.9 X 4.9 mm, Pitch 1.27 mm; Applications: Embedded; Package: SO8 Narrow; Part Status: Production; RoHS: Yes; Type: Data Storage; Width: x1; Mounting Technology: Surface Mount; PartNumber: M25P40-VMN6P; ComponentLink1Description: MD_Anufacturer URL; ComponentLink1URL: http://www.micron.com/; ComponentLink2Description: Datasheet; ComponentLink2URL: http://www.micron.com/~/media/Documents/Products/Data%20Sheet/NOR%20Flash/Serial%20NOR/M25P/M25P40.pdf; ComponentLink3Description: Package Specification; ComponentLink3URL: http://www.micron.com/~/media/Documents/Products/Data%20Sheet/NOR%20Flash/Serial%20NOR/M25P/M25P05A.pdf; Manufacturer Part Number: M25P40-VMN6P
U10 = SN74LVC1G00DBVT: Single 2 Input Positive NAND Gate, DBV0005A, SMALL T&R; Manufacturer: Texas Instruments; VCC(Min)(V): 1.65; VCC(Max)(V): 5.5; Output Type: CMOS; ICC @ Nom Voltage(Max)(mA): 0.01; Input Type: CMOS/TTL; Bits(#): 1; F @ Nom Voltage(Max)(Mhz): 150; Rating: Catalog; Technology Family: LVC; Voltage(Nom)(V): 1.8,2.5,3.3,5; Schmitt Trigger: No; Output Drive (IOL/IOH)(Max)(mA): 32/-32; tpd @ Nom Voltage(Max)(ns): 9,5.5,4.7,4; Logic: True; DatasheetVersion: SCES212AB; PackageReference: DBV0005A; Supplier 1: Mouser; Supplier Part Number 1: 595-SN74LVC1G00DBVT; Supplier 2: Digi-Key; Supplier Part Number 2: 296-32286-2-ND; Supplier 3: Digi-Key; Supplier Part Number 3: 296-32286-1-ND; Supplier 4: Digi-Key; Supplier Part Number 4: 296-32286-6-ND; Generic Part Number: SN74LVC1G00; Operating Temperature Range(C): -40 to 125,-40 to 85; Gate Type: NAND; Sub-Family: NAND Gate; 3-State Output: No; PartNumber: SN74LVC1G00DBVT; ComponentLink1Description: MD_Anufacturer URL; ComponentLink1URL: http://www.ti.com/; ComponentLink2Description: Datasheet; ComponentLink2URL: http://www.ti.com/lit/ds/symlink/sn74lvc1g00.pdf; Manufacturer Part Number: SN74LVC1G00DBVT
U11 = MC74VHC4053DT: Analog Multiplexer/Demultiplexer; Manufacturer: Onsemi; ComponentAvailability: Active; Published: 15-Apr-2002; LatestRevisionDate: 12-Dec-2006; LatestRevisionNote: IPC-7351 Footprint Added.; DatasheetVersion: MD_Ar-2000; PackageVersion: Feb-2000; PackageReference: 948F-01; Publisher: Altium Limited; PackageDescription: 16-Pin Thin SMD_All Outline Package 0.65 mm Pitch; ComponentLink1Description: Manufacturer Link; ComponentLink1URL: http://www.onsemi.com/; ComponentLink2Description: Datasheet; ComponentLink2URL: http://www.onsemi.com/pub/Collateral/MC74VHC4053DT.PDF; Manufacturer Part Number: MC74VHC4053DTR2G
Y1 = Crystal_6MHz_HC49/US: Resonator Quartz 24.00 MHz 30ppm; Manufacturer: CTS-Frequency Controls; Manufacturer Part Number: ATS240BSM-1E; Frequency Stability: ±50ppm; Load Capacitance: 18pF; Operating Mode: Fundamental; Parameter Name: 0.169" (4.30mm); Package / Case: HC49/US-SM; Ratings: 24.00 MHz; Supplier 1: Digi-Key; Supplier Part Number 1: CTX1124CT-ND; Type: MHz Crystal; Frequency: 24MHz; Frequency Tolerance: ±30ppm; Operating Temperature: -20°C ~ 70°C; Mounting Type: Surface Mount; Size / Dimension: 0.437" L x 0.190" W (11.10mm x 4.83mm); ComponentLink1URL: https://www.ctscorp.com/Files/DataSheets/Passives/FCP/Crystals/crystals-ATS-ATSSM-datasheet.pdf; ComponentLink1Description: Datasheet